# EAGLE schematic step1 (EAGLE 7.6.0)
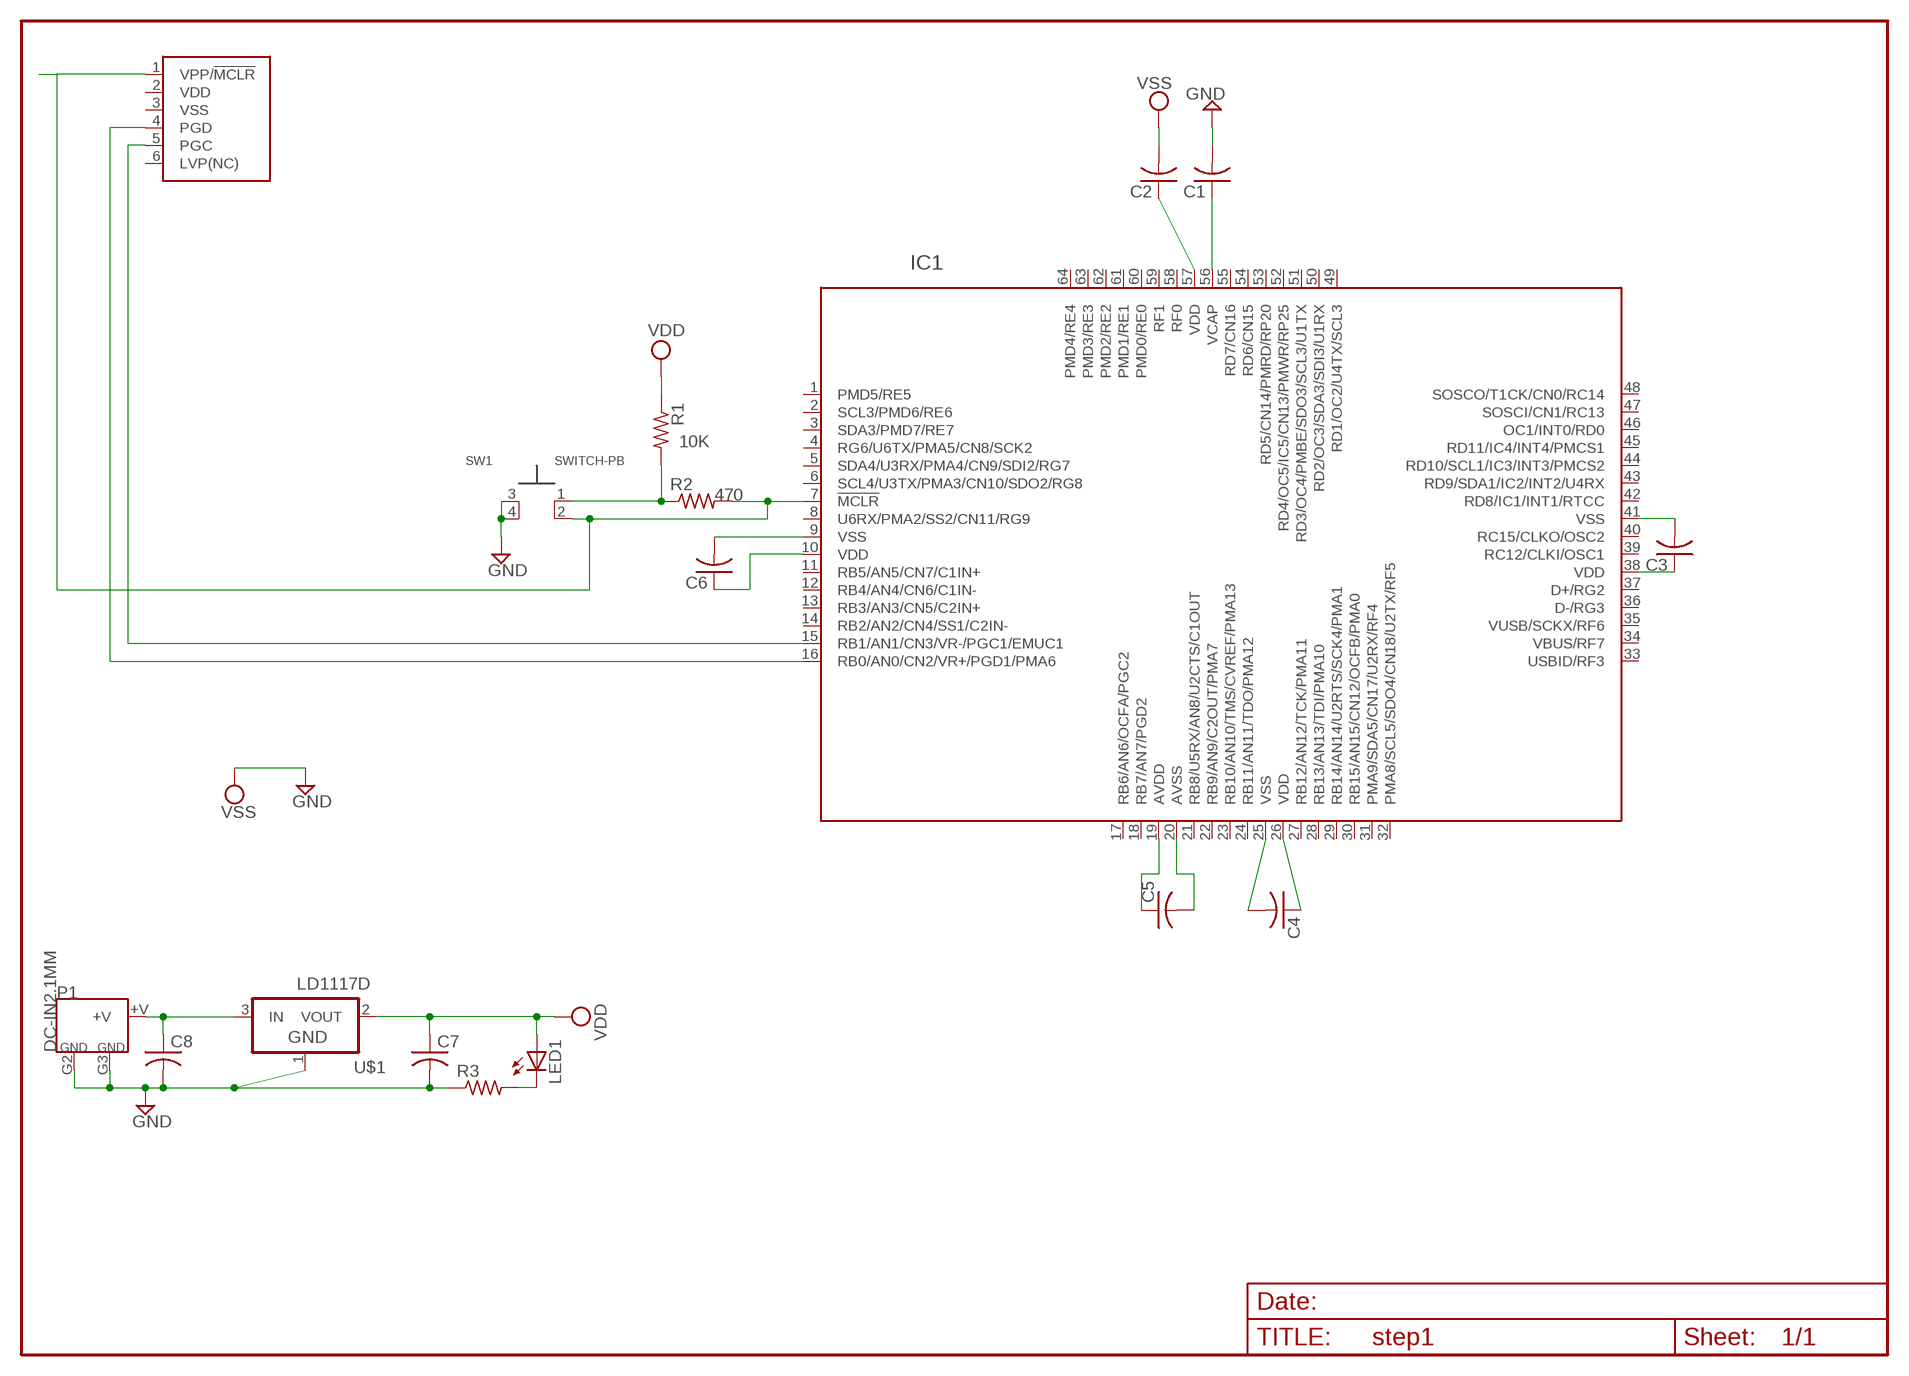
[diagram p0: schematic, sheet 1]

## Parts
C1  C-USC1206  [C1206]
C2  C-USC0805  [C0805]
C3  C-USC0805  [C0805]
C4  C-USC0805  [C0805]
C5  C-USC0805  [C0805]
C6  C-USC0805  [C0805]
C7  C-USC0603  [C0603]
C8  C-USC0603  [C0603]
IC1  PIC32MX795  [TQFP64-10X10RMS]
LED1  LEDSMT1206  [1206]
P1  DC-IN2.1MM  [DC-POWERJACK]
R1  R-US_R0603  [R0603]
R2  R-US_R0603  [R0603]
R3  R-US_R0805  [R0805]
SW1  SWITCH-PB  [PBSWITCH]
U$1  LD1117D  [DPAK]
U$2  PICKIT3  [PICKIT3]

## Nets
+V: C8.1 P1.+V U$1.3(IN)
GND: C1.2 C7.2 C8.2 P1.G2 P1.G3 R3.1 SW1.3 SW1.4 U$1.1(GND) ; supply symbol labelled VSS
N$1: R1.2 R2.1 SW1.1
N$2: IC1.7(!MCLR) R2.2 SW1.2 U$2.1(VPP/!MCLR)
N$3: C1.1 IC1.56(VCAP)
N$4: C2.1 IC1.57(VDD)
N$5: C3.2 IC1.41(VSS)
N$6: C3.1 IC1.38(VDD)
N$7: C4.2 IC1.25(VSS)
N$8: C4.1 IC1.26(VDD)
N$9: C5.1 IC1.19(AVDD)
N$10: C5.2 IC1.20(AVSS)
N$11: C6.2 IC1.9(VSS)
N$12: C6.1 IC1.10(VDD)
N$13: LED1.C R3.2
N$14: IC1.15(RB1/AN1/CN3/VR-/PGC1/EMUC1) U$2.5(PGC)
N$15: IC1.16(RB0/AN0/CN2/VR+/PGD1/PMA6) U$2.4(PGD)
VDD: C7.1 LED1.A R1.1 U$1.2(VOUT)
VSS: C2.2
Unconnected: IC1.1(PMD5/RE5) IC1.2(SCL3/PMD6/RE6) IC1.3(SDA3/PMD7/RE7) IC1.4(RG6/U6TX/PMA5/CN8/SCK2) IC1.5(SDA4/U3RX/PMA4/CN9/SDI2/RG7) IC1.6(SCL4/U3TX/PMA3/CN10/SDO2/RG8) IC1.8(U6RX/PMA2/SS2/CN11/RG9) IC1.11(RB5/AN5/CN7/C1IN+) IC1.12(RB4/AN4/CN6/C1IN-) IC1.13(RB3/AN3/CN5/C2IN+) IC1.14(RB2/AN2/CN4/SS1/C2IN-) IC1.17(RB6/AN6/OCFA/PGC2) IC1.18(RB7/AN7/PGD2) IC1.21(RB8/U5RX/AN8/U2CTS/C1OUT) IC1.22(RB9/AN9/C2OUT/PMA7) IC1.23(RB10/AN10/TMS/CVREF/PMA13) IC1.24(RB11/AN11/TDO/PMA12) IC1.27(RB12/AN12/TCK/PMA11) IC1.28(RB13/AN13/TDI/PMA10) IC1.29(RB14/AN14/U2RTS/SCK4/PMA1) IC1.30(RB15/AN15/CN12/OCFB/PMA0) IC1.31(PMA9/SDA5/CN17/U2RX/RF4) IC1.32(PMA8/SCL5/SDO4/CN18/U2TX/RF5) IC1.33(USBID/RF3) IC1.34(VBUS/RF7) IC1.35(VUSB/SCKX/RF6) IC1.36(D-/RG3) IC1.37(D+/RG2) IC1.39(RC12/CLKI/OSC1) IC1.40(RC15/CLKO/OSC2) IC1.42(RD8/IC1/INT1/RTCC) IC1.43(RD9/SDA1/IC2/INT2/U4RX) IC1.44(RD10/SCL1/IC3/INT3/PMCS2) IC1.45(RD11/IC4/INT4/PMCS1) IC1.46(OC1/INT0/RD0) IC1.47(SOSCI/CN1/RC13) IC1.48(SOSCO/T1CK/CN0/RC14) IC1.49(RD1/OC2/U4TX/SCL3) IC1.50(RD2/OC3/SDA3/SDI3/U1RX) IC1.51(RD3/OC4/PMBE/SDO3/SCL3/U1TX) IC1.52(RD4/OC5/IC5/CN13/PMWR/RP25) IC1.53(RD5/CN14/PMRD/RP20) IC1.54(RD6/CN15) IC1.55(RD7/CN16) IC1.58(RF0) IC1.59(RF1) IC1.60(PMD0/RE0) IC1.61(PMD1/RE1) IC1.62(PMD2/RE2) IC1.63(PMD3/RE3) IC1.64(PMD4/RE4) U$2.6(LVP(NC))

## Power pins joined to a net without a drawn wire
GND: U$2.3(VSS)
VDD: U$2.2(VDD)

## Library data of the parts
C1-C8 = rcl:C-US: CAPACITOR, American symbol
IC1 = RMSlib:PIC32MX795
LED1 = RMSlib:LED: LED OSRAM: - CHIPLED LG R971, LG N971, LY N971, LG Q971, LY Q971, LO R971, LY R971 LH N974, LH R974 LS Q976, LO Q976, LY Q976 LO Q996 - Hyper CHIPLED LW Q18S LB Q993, LB Q99A, LB R99A - SideLED LS A670, LO A670, LY A670, LG A670, LP A670 LB A673, LV A673, LT A673, LW A673 LH A674 LY A675 LS A676, LA A676, LO A676, LY A676, LW A676 LS A679, LY A679, LG A679 - Hyper Micro SIDELED® LS Y876, LA Y876, LO Y876, LY Y876 LT Y87S - SmartLED LW L88C, LW L88S LB L89C, LB L89S, LG L890 LS L89K, LO L89K, LY L89K LS L896, LA L896, LO L896, LY L896 - TOPLED LS T670, LO T670, LY T670, LG T670, LP T670 LSG T670, LSP T670, LSY T670, LOP T670, LYG T670 LG T671, LOG T671, LSG T671 LB T673, LV T673, LT T673, LW T673 LH T674 LS T676, LA T676, LO T676, LY T676, LB T676, LH T676, LSB T676, LW T676 LB T67C, LV T67C, LT T67C, LS T67K, LO T67K, LY T67K, LW E67C LS E67B, LA E67B, LO E67B, LY E67B, LB E67C, LV E67C, LT E67C LW T67C LS T679, LY T679, LG T679 LS T770, LO T770, LY T770, LG T770, LP T770 LB T773, LV T773, LT T773, LW T773 LH T774 LS E675, LA E675, LY E675, LS T675 LS T776, LA T776, LO T776, LY T776, LB T776 LHGB T686 LT T68C, LB T68C - Hyper Mini TOPLED® LB M676 - Mini TOPLED Santana® LG M470 LS M47K, LO M47K, LY M47K Source: http://www.osram.convergy.de - LUMILED® LXK2-PW12-R00, LXK2-PW12-S00, LXK2-PW14-U00, LXK2-PW14-V00 LXK2-PM12-R00, LXK2-PM12-S00, LXK2-PM14-U00 LXK2-PE12-Q00, LXK2-PE12-R00, LXK2-PE12-S00, LXK2-PE14-T00, LXK2-PE14-U00 LXK2-PB12-K00, LXK2-PB12-L00, LXK2-PB12-M00, LXK2-PB14-N00, LXK2-PB14-P00, LXK2-PB14-Q00 LXK2-PR12-L00, LXK2-PR12-M00, LXK2-PR14-Q00, LXK2-PR14-R00 LXK2-PD12-Q00, LXK2-PD12-R00, LXK2-PD12-S00 LXK2-PH12-R00, LXK2-PH12-S00 LXK2-PL12-P00, LXK2-PL12-Q00, LXK2-PL12-R00 Source: www.luxeon.com
P1 = RMSlib:DC-IN
R1 = rcl:R-US_: RESISTOR, American symbol; RESISTANCE: 10K
R2 = rcl:R-US_: RESISTOR, American symbol; RESISTANCE: 470
R3 = rcl:R-US_: RESISTOR, American symbol
SW1 = RMSlib:SWITCH-PB
U$1 = RMSlib:LD1117: SMT voltage regulator
U$2 = RMSlib:PICKIT3

## Net classes
0 Default: width 0.254 mm, drill 0.203 mm, clearance 0.254 mm
1 Power: width 0.61 mm, drill 0.305 mm, clearance 0.254 mm
2 Signal: width 0.305 mm, drill 0.305 mm, clearance 0.254 mm
3 LVSignal: width 0.254 mm, drill 0.254 mm, clearance 0.254 mm